# EAGLE design MainBoard (EAGLE 5.11)
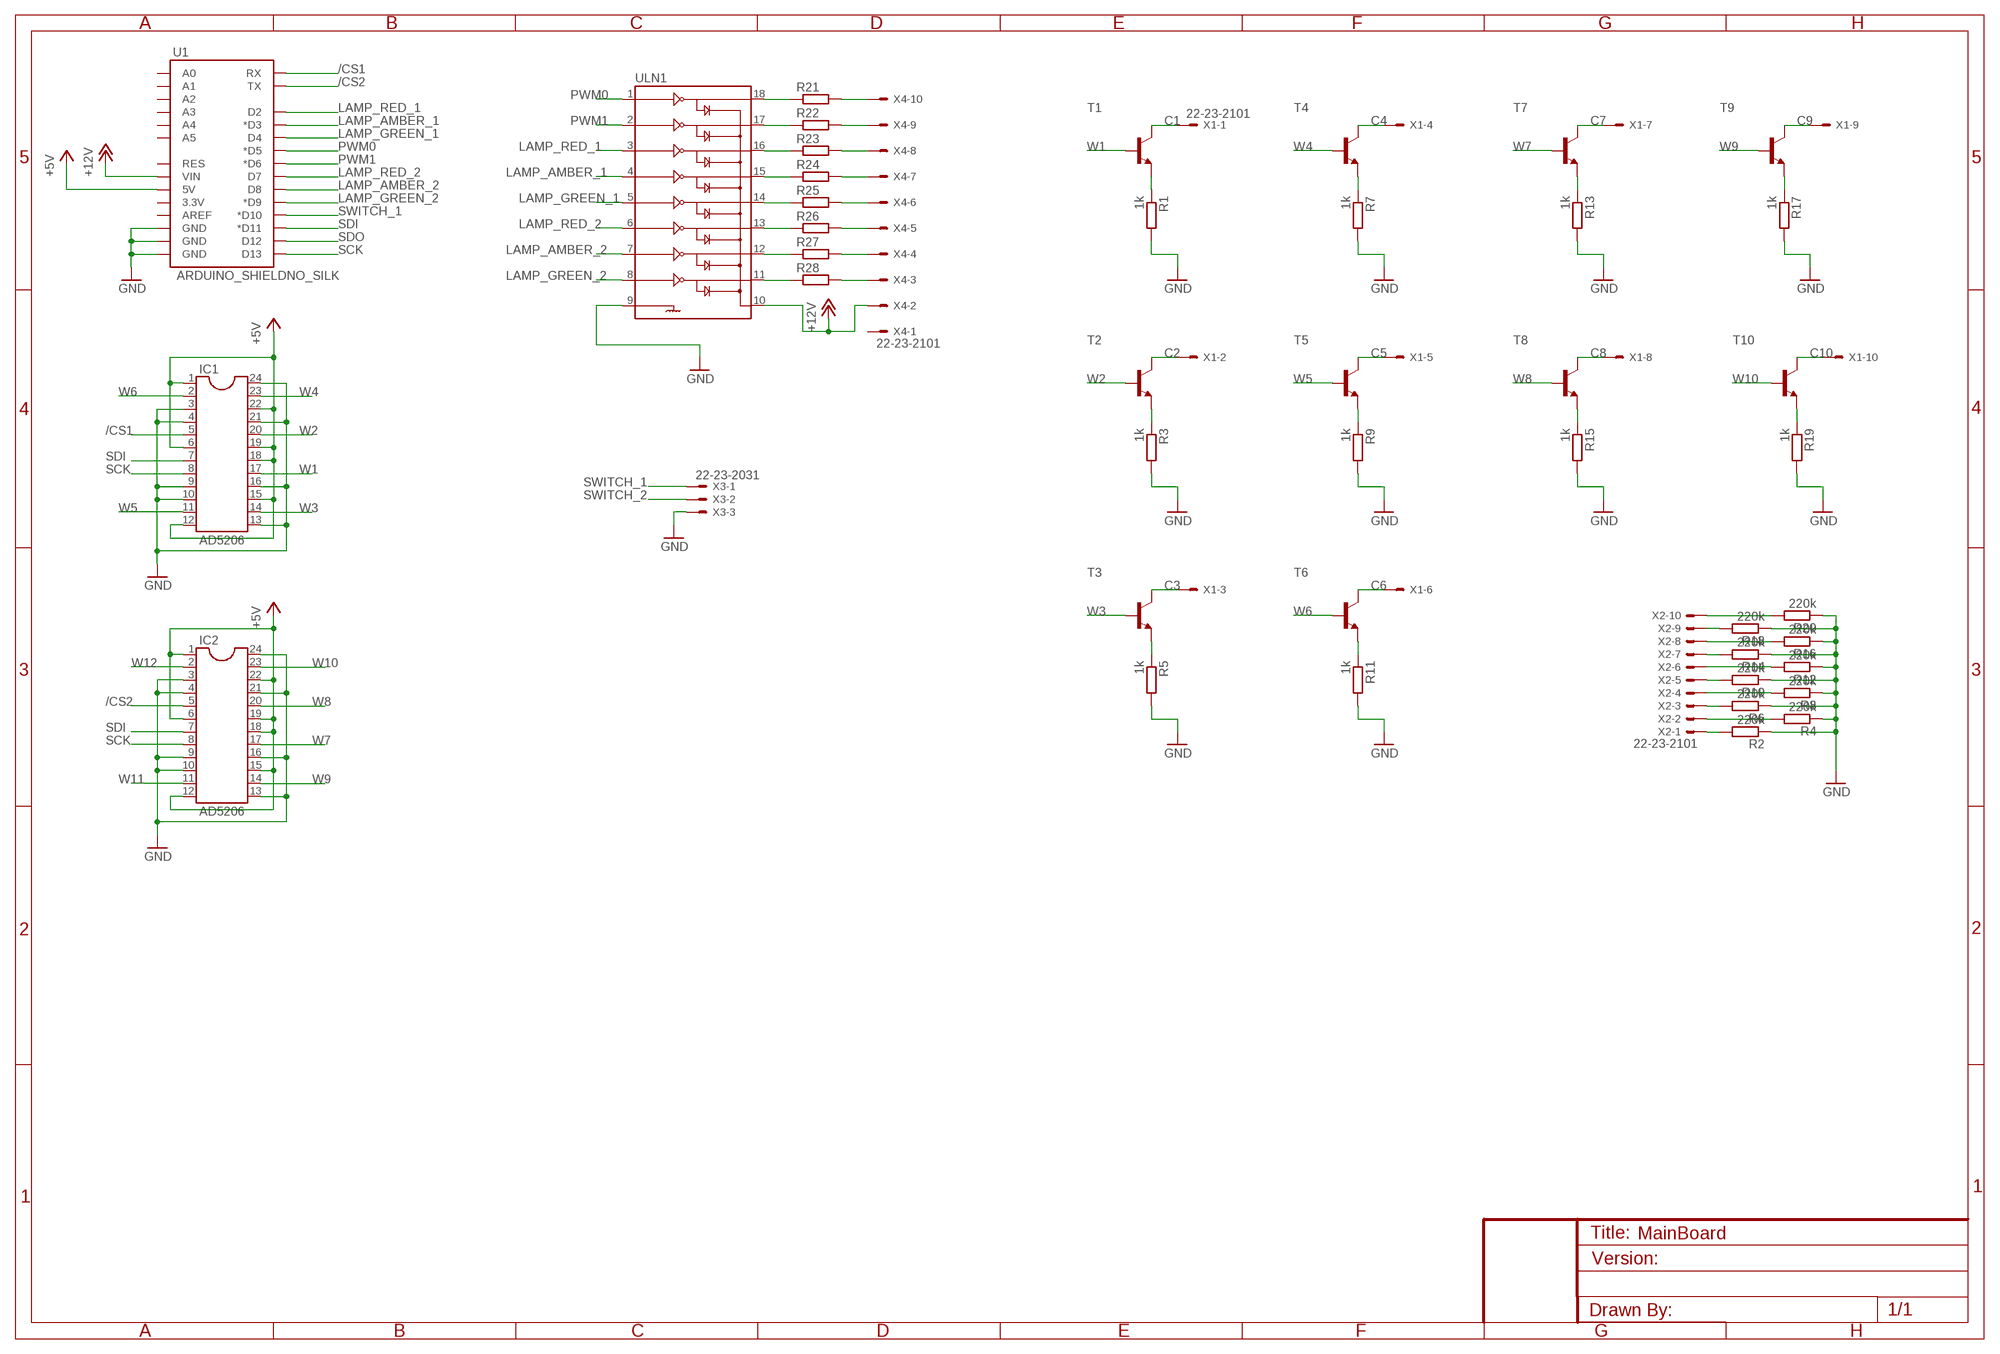
[diagram p0: schematic, sheet 1]

## Parts
IC1  AD5206  DIL24-3  [DIL24-3]
IC2  AD5206  DIL24-3  [DIL24-3]
R1  1k  R-EU_0207/2V  [0207/2V]
R2  220k  R-EU_0207/2V  [0207/2V]
R3  1k  R-EU_0207/2V  [0207/2V]
R4  220k  R-EU_0207/2V  [0207/2V]
R5  1k  R-EU_0207/2V  [0207/2V]
R6  220k  R-EU_0207/2V  [0207/2V]
R7  1k  R-EU_0207/2V  [0207/2V]
R8  220k  R-EU_0207/2V  [0207/2V]
R9  1k  R-EU_0207/2V  [0207/2V]
R10  220k  R-EU_0207/2V  [0207/2V]
R11  1k  R-EU_0207/2V  [0207/2V]
R12  220k  R-EU_0207/2V  [0207/2V]
R13  1k  R-EU_0207/2V  [0207/2V]
R14  220k  R-EU_0207/2V  [0207/2V]
R15  1k  R-EU_0207/2V  [0207/2V]
R16  220k  R-EU_0207/2V  [0207/2V]
R17  1k  R-EU_0207/2V  [0207/2V]
R18  220k  R-EU_0207/2V  [0207/2V]
R19  1k  R-EU_0207/2V  [0207/2V]
R20  220k  R-EU_0207/2V  [0207/2V]
R21  R-EU_0207/2V  [0207/2V]
R22  R-EU_0207/2V  [0207/2V]
R23  R-EU_0207/2V  [0207/2V]
R24  R-EU_0207/2V  [0207/2V]
R25  R-EU_0207/2V  [0207/2V]
R26  R-EU_0207/2V  [0207/2V]
R27  R-EU_0207/2V  [0207/2V]
R28  R-EU_0207/2V  [0207/2V]
T1  MPSA42-NPN-TO92-CBE  [TO92-CBE]
T2  MPSA42-NPN-TO92-CBE  [TO92-CBE]
T3  MPSA42-NPN-TO92-CBE  [TO92-CBE]
T4  MPSA42-NPN-TO92-CBE  [TO92-CBE]
T5  MPSA42-NPN-TO92-CBE  [TO92-CBE]
T6  MPSA42-NPN-TO92-CBE  [TO92-CBE]
T7  MPSA42-NPN-TO92-CBE  [TO92-CBE]
T8  MPSA42-NPN-TO92-CBE  [TO92-CBE]
T9  MPSA42-NPN-TO92-CBE  [TO92-CBE]
T10  MPSA42-NPN-TO92-CBE  [TO92-CBE]
U1  ARDUINO_SHIELDNO_SILK  [DUEMILANOVE_VIAS]
ULN1  ULN2803DIP  [DIL18]
X1  22-23-2101  [22-23-2101]
X2  22-23-2101  [22-23-2101]
X3  22-23-2031  [22-23-2031]
X4  22-23-2101  [22-23-2101]

## Nets
+5V: IC1.1 IC1.6 IC1.12 IC1.15 IC1.18 IC1.19 IC1.22 IC2.1 IC2.6 IC2.12 IC2.15 IC2.18 IC2.19 IC2.22 U1.5V
+12V: U1.VIN ULN1.10 X4.2
/CS1: IC1.5 U1.RX
/CS2: IC2.5 U1.TX
C1 [ht]: T1.C X1.1
C2 [ht]: T2.C X1.2
C3 [ht]: T3.C X1.3
C4 [ht]: T4.C X1.4
C5 [ht]: T5.C X1.5
C6 [ht]: T6.C X1.6
C7 [ht]: T7.C X1.7
C8 [ht]: T8.C X1.8
C9 [ht]: T9.C X1.9
C10 [ht]: T10.C X1.10
GND: IC1.3 IC1.4 IC1.9 IC1.10 IC1.13 IC1.16 IC1.21 IC1.24 IC2.3 IC2.4 IC2.9 IC2.10 IC2.13 IC2.16 IC2.21 IC2.24 R1.2 R2.1 R3.2 R4.1 R5.2 R6.1 R7.2 R8.1 R9.2 R10.1 R11.2 R12.1 R13.2 R14.1 R15.2 R16.1 R17.2 R18.1 R19.2 R20.1 U1.GND@0(GND) U1.GND@1(GND) U1.GND@2(GND) ULN1.9 X3.3
LAMP_AMBER_1: U1.D3(*D3) ULN1.4
LAMP_AMBER_2: U1.D8 ULN1.7
LAMP_GREEN_1: U1.D4 ULN1.5
LAMP_GREEN_2: U1.D9(*D9) ULN1.8
LAMP_RED_1: U1.D2 ULN1.3
LAMP_RED_2: U1.D7 ULN1.6
N$1: R1.1 T1.E
N$2: R13.1 T7.E
N$3: R20.2 X2.10
N$4: R18.2 X2.9
N$5: R16.2 X2.8
N$6: R14.2 X2.7
N$7: R12.2 X2.6
N$8: R10.2 X2.5
N$9: R5.1 T3.E
N$10: R8.2 X2.4
N$11: R6.2 X2.3
N$12: R7.1 T4.E
N$13: R21.1 ULN1.18
N$14: R4.2 X2.2
N$15: R9.1 T5.E
N$16: R22.1 ULN1.17
N$17: R3.1 T2.E
N$18: R2.2 X2.1
N$19: R11.1 T6.E
N$20: R23.1 ULN1.16
N$21: R24.1 ULN1.15
N$22: R25.1 ULN1.14
N$23: R26.1 ULN1.13
N$24: R15.1 T8.E
N$25: R27.1 ULN1.12
N$26: R28.1 ULN1.11
N$27: R17.1 T9.E
N$28: R21.2 X4.10
N$29: R22.2 X4.9
N$30: R19.1 T10.E
N$31: R23.2 X4.8
N$32: R24.2 X4.7
N$33: R25.2 X4.6
N$34: R26.2 X4.5
N$35: R27.2 X4.4
N$36: R28.2 X4.3
PWM0: U1.D5(*D5) ULN1.1
PWM1: U1.D6(*D6) ULN1.2
SCK: IC1.8 IC2.8 U1.D13
SDI: IC1.7 IC2.7 U1.D11(*D11)
SDO: U1.D12
SWITCH_1: U1.D10(*D10) X3.1
SWITCH_2: X3.2
W1: IC1.17 T1.B
W2: IC1.20 T2.B
W3: IC1.14 T3.B
W4: IC1.23 T4.B
W5: IC1.11 T5.B
W6: IC1.2 T6.B
W7: IC2.17 T7.B
W8: IC2.20 T8.B
W9: IC2.14 T9.B
W10: IC2.23 T10.B
W11: IC2.11
W12: IC2.2
Unconnected: U1.3.3V U1.A0 U1.A1 U1.A2 U1.A3 U1.A4 U1.A5 U1.AREF U1.RES X4.1

## Library data of the parts
IC1 IC2 = ic-package:DIL24: Dual In Line
R1-R28 = CustomisedParts:R-EU_: RESISTOR, European symbol
T1-T10 = transistor:*-NPN-: NPN Transistror BF959 corrected 2008.03.06
U1 = SparkFun:ARDUINO_SHIELD
ULN1 = SparkFun:ULN2803: Darlington Driver ULN2803 Darlington array. 500mA max per channel, 8-channel package. Spark Fun Electronics SKU : COM-00312
X1 X2 X4 = con-molex:22-23-2101: .100" (2.54mm) Center Header - 10 Pin; MF: MOLEX; MPN: 22-23-2101; OC_FARNELL: 1756828; OC_NEWARK: 94C0765
X3 = con-molex:22-23-2031: .100" (2.54mm) Center Header - 3 Pin; MF: MOLEX; MPN: 22-23-2031; OC_FARNELL: 1462950; OC_NEWARK: 30C0862

## Net classes
0 default: width 0.305 mm, clearance 0.254 mm
1 ht: width 0.508 mm, clearance 0.254 mm

## Board
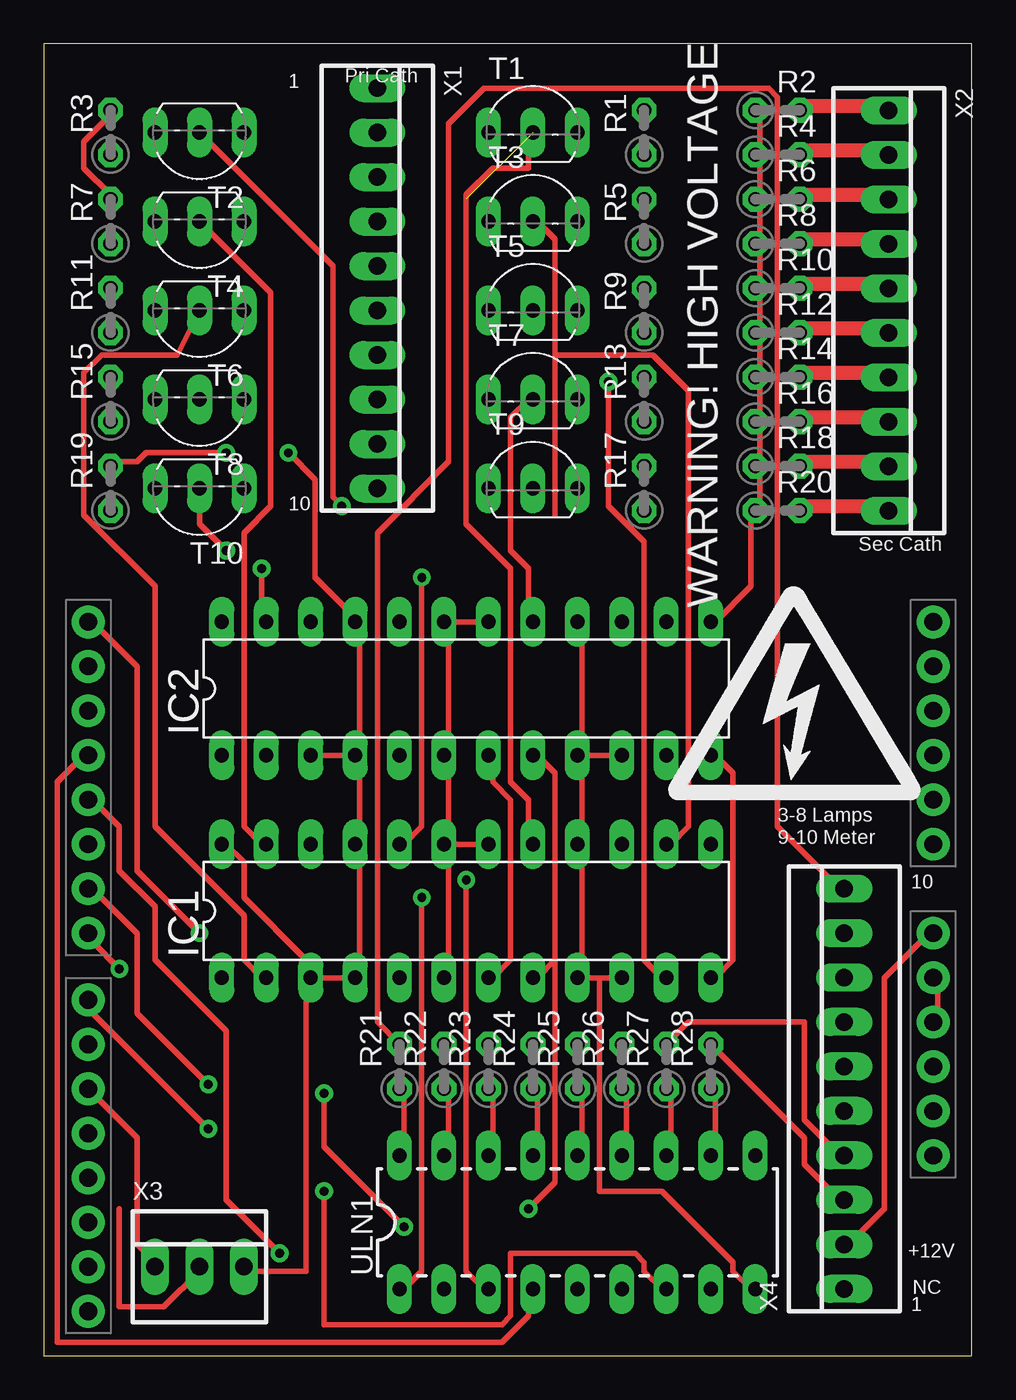
[diagram p1: board, top side]
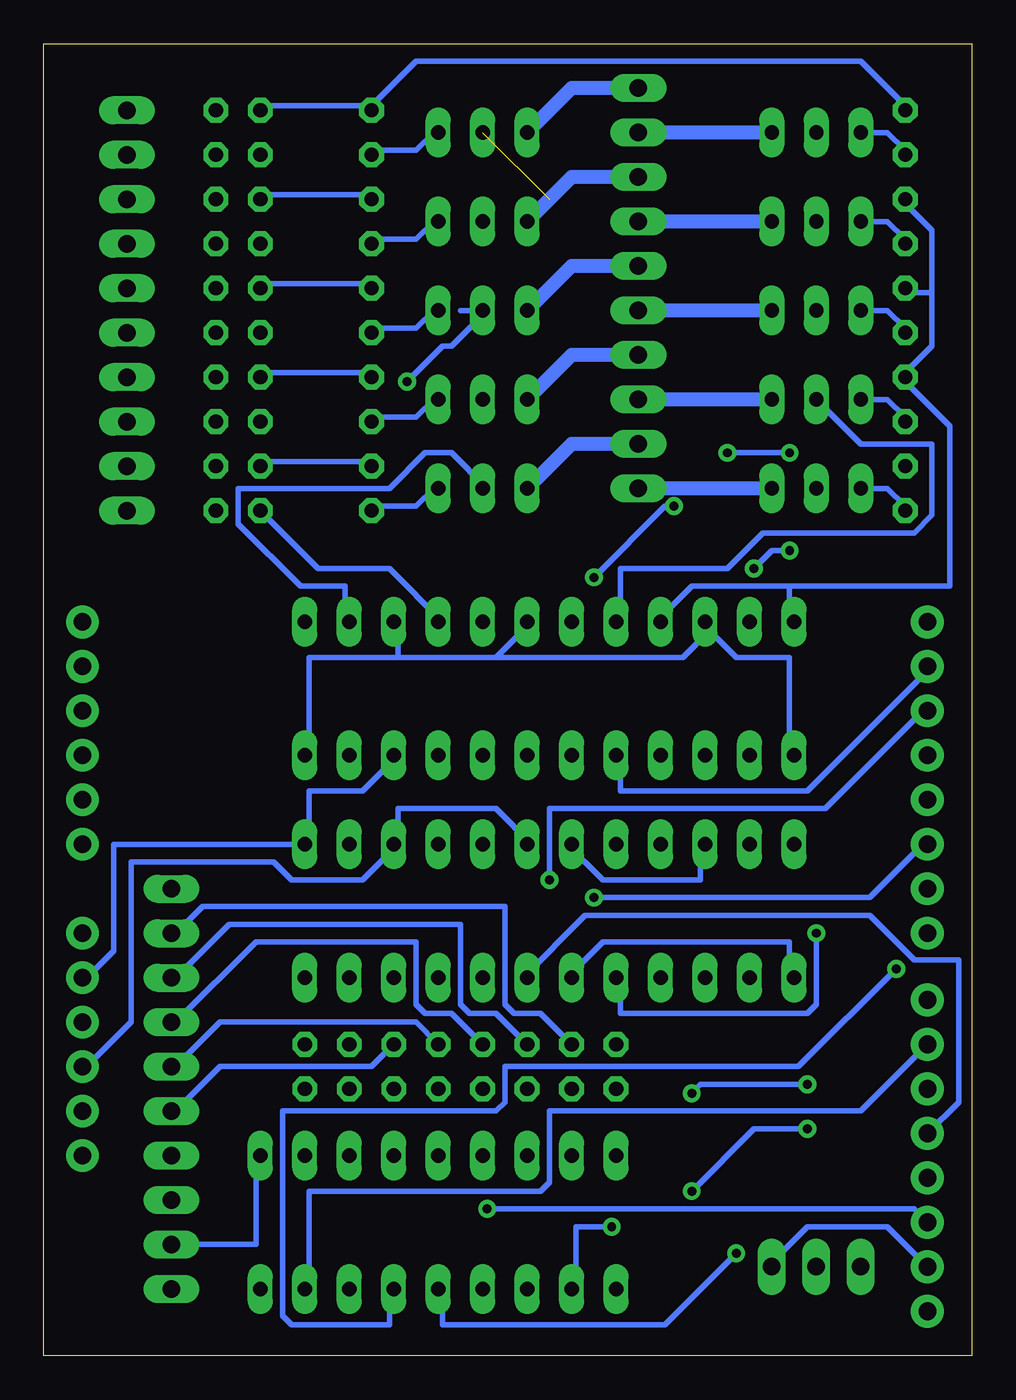
[diagram p2: board, bottom side, seen from below]

Size 53.01 x 74.92 mm. Coordinates in mm from the lower left corner, seen from the top.
Outline: 0,0 53.01,0 53.01,74.92 0,74.92 0,0
Copper layers (1*16): Top 0.035mm / dielectric 1.5mm / Bottom 0.035mm
Design rules "SparkFun": minimum track width 8mil, minimum drill 20mil, track to track 8mil, track to pad 8mil, pad to pad 8mil, via to via 8mil, smd to smd 8mil, copper to edge 10mil, drill to drill 8mil, minimum pad ring 12mil, minimum via ring 10mil, stop-mask expansion 4mil, vias tented up to drill 25mil, thermal gap 10mil

### Footprints (pad centres in the part's own frame; a part is rotated, then mirrored left to right if it is on the bottom)
DIL24-3 = drill 0.813 long: 1 -13.97,-3.81; 2 -11.43,-3.81; 3 -8.89,-3.81; 4 -6.35,-3.81; 5 -3.81,-3.81; 6 -1.27,-3.81; 7 1.27,-3.81; 8 3.81,-3.81; 9 6.35,-3.81; 10 8.89,-3.81; 11 11.43,-3.81; 12 13.97,-3.81; 13 13.97,3.81; 14 11.43,3.81; 15 8.89,3.81; 16 6.35,3.81; 17 3.81,3.81; 18 1.27,3.81; 19 -1.27,3.81; 20 -3.81,3.81; 21 -6.35,3.81; 22 -8.89,3.81; 23 -11.43,3.81; 24 -13.97,3.81
0207/2V = drill 0.813 octagon: 1 -1.27,0; 2 1.27,0
TO92-CBE = drill 0.813 long: B 0,0; C -2.54,0; E 2.54,0
DUEMILANOVE_VIAS = drill 1.016 pad 1.88 round: 3.3V 50.8,13.97; 5V 50.8,16.51; A0 50.8,29.21; A1 50.8,31.75; A2 50.8,34.29; A3 50.8,36.83; A4 50.8,39.37; A5 50.8,41.91; AREF 2.54,2.54; D2 2.54,36.83; D3 2.54,34.29; D4 2.54,31.75; D5 2.54,29.21; D6 2.54,26.67; D7 2.54,24.13; D8 2.54,20.32; D9 2.54,17.78; D10 2.54,15.24; D11 2.54,12.7; D12 2.54,10.16; D13 2.54,7.62; GND@0 50.8,19.05; GND@1 50.8,21.59; GND@2 2.54,5.08; RES 50.8,11.43; RX 2.54,41.91; TX 2.54,39.37; VIN 50.8,24.13
DIL18 = drill 0.813 long: 1 -10.16,-3.81; 2 -7.62,-3.81; 3 -5.08,-3.81; 4 -2.54,-3.81; 5 0,-3.81; 6 2.54,-3.81; 7 5.08,-3.81; 8 7.62,-3.81; 9 10.16,-3.81; 10 10.16,3.81; 11 7.62,3.81; 12 5.08,3.81; 13 2.54,3.81; 14 0,3.81; 15 -2.54,3.81; 16 -5.08,3.81; 17 -7.62,3.81; 18 -10.16,3.81
22-23-2101 = drill 1 long: 1 -11.43,0; 2 -8.89,0; 3 -6.35,0; 4 -3.81,0; 5 -1.27,0; 6 1.27,0; 7 3.81,0; 8 6.35,0; 9 8.89,0; 10 11.43,0
22-23-2031 = drill 1 long: 1 -2.54,0; 2 0,0; 3 2.54,0

### Placement (x,y rotation side)
IC1  24.13,25.4 0 top
IC2  24.13,38.1 0 top
R1  34.29,69.85 90 top
R2  41.91,71.12 0 top
R3  3.81,69.85 90 top
R4  41.91,68.58 0 top
R5  34.29,64.77 90 top
R6  41.91,66.04 0 top
R7  3.81,64.77 90 top
R8  41.91,63.5 0 top
R9  34.29,59.69 90 top
R10  41.91,60.96 0 top
R11  3.81,59.69 90 top
R12  41.91,58.42 0 top
R13  34.29,54.61 90 top
R14  41.91,55.88 0 top
R15  3.81,54.61 90 top
R16  41.91,53.34 0 top
R17  34.29,49.53 90 top
R18  41.91,50.8 0 top
R19  3.81,49.53 90 top
R20  41.91,48.26 0 top
R21  20.32,16.51 90 top
R22  22.86,16.51 90 top
R23  25.4,16.51 90 top
R24  27.94,16.51 90 top
R25  30.48,16.51 90 top
R26  33.02,16.51 90 top
R27  35.56,16.51 90 top
R28  38.1,16.51 90 top
T1  27.94,69.85 0 top
T2  8.89,69.85 180 top
T3  27.94,64.77 0 top
T4  8.89,64.77 180 top
T5  27.94,59.69 0 top
T6  8.89,59.69 180 top
T7  27.94,54.61 0 top
T8  8.89,54.61 180 top
T9  27.94,49.53 0 top
T10  8.89,49.53 180 top
U1  0,0 0 top
ULN1  30.48,7.62 0 top
X1  19.05,60.96 270 top
X2  48.26,59.69 270 top
X3  8.89,5.08 0 top
X4  45.72,15.24 90 top

### Tracks (layer width: path | path; a pad name or v marks a point on that pad's centre or on a via)
+5V
  Top 0.305: IC1.12 38.35,21.59 39.37,22.61 39.37,33.27 38.35,34.29 IC2.12 | 23.11,41.91 IC2.18 | 23.11,29.21 IC1.18 | 23.11,29.21 23.11,34.29 | 23.11,34.29 23.11,41.91 | 23.11,41.91 IC2.19 | 23.11,34.29 IC2.6 | 23.11,29.21 23.11,21.59 IC1.6 | 23.11,29.21 IC1.19
  Bottom 0.305: IC1.1 10.41,21.59 10.41,23.62 21.08,23.62 23.11,21.59 IC1.6 | 14.99,41.4 15.49,41.91 IC2.22 14.99,41.4 | 14.99,41.4 13.46,39.88 10.41,39.88 10.41,34.29 IC2.1 | 32.77,39.88 32.77,41.91 IC2.15 | 27.18,39.88 32.77,39.88 | 27.18,39.88 25.15,41.91 IC2.18 | IC1.22 15.49,29.21 15.49,27.18 21.08,27.18 23.11,29.21 IC1.19 | 32.77,29.21 32.77,31.24 27.18,31.24 25.15,29.21 IC1.18 | 32.77,29.21 34.8,27.18 38.86,27.18 39.88,28.19 48.01,28.19 48.01,19.05 50.55,16.51 U1.5V | 32.77,29.21 IC1.15 | 14.99,41.4 16.51,39.88 27.18,39.88 | 32.77,39.88 37.85,39.88 37.85,34.29 IC2.12
+12V
  Top 0.305: U1.VIN 50.55,24.13 48.01,21.59 48.01,8.38 45.97,6.35 X4.2
  Bottom 0.305: ULN1.10 40.89,11.43 40.89,6.35 X4.2
/CS1  (via drill 0.51)
  Top 0.305: v8.89,24.13 5.33,27.69 5.33,39.37 2.79,41.91 U1.RX
  Bottom 0.305: v8.89,24.13 8.89,20.07 9.4,19.56 20.07,19.56 20.07,21.59 IC1.5
/CS2
  Bottom 0.305: IC2.5 20.07,34.29 20.07,32.26 9.4,32.26 2.29,39.37 U1.TX
C1
  Bottom 0.813: T1.C 22.86,72.39 X1.1
C2
  Bottom 0.813: T2.C X1.2
C3
  Bottom 0.813: T3.C 22.86,67.31 X1.3
C4
  Bottom 0.813: T4.C X1.4
C5
  Bottom 0.813: T5.C 22.86,62.23 X1.5
C6
  Bottom 0.813: T6.C X1.6
C7
  Bottom 0.813: T7.C 22.86,57.15 X1.7
C8
  Bottom 0.813: T8.C X1.8
C9
  Bottom 0.813: T9.C 22.86,52.07 X1.9
C10
  Bottom 0.813: T10.C X1.10
GND  (via drill 0.51)
  Top 0.305: R3.2 3.81,70.87 2.29,69.34 2.29,67.82 3.81,66.29 R7.2 | v10.41,51.56 5.84,51.56 5.33,51.05 3.81,51.05 R19.2 | R2.1 40.89,70.87 40.89,68.83 R4.1 40.89,68.33 40.89,66.29 R6.1 40.89,65.79 40.89,63.75 R8.1 40.89,63.25 40.89,61.21 R10.1 40.89,60.71 40.89,58.67 R12.1 40.89,58.17 40.89,56.13 R14.1 40.89,55.63 40.89,53.59 R16.1 40.89,53.09 40.89,51.05 R18.1 40.89,50.55 40.89,48.51 R20.1 40.39,48.01 40.39,43.94 38.35,41.91 IC2.13 | U1.GND@0 51.05,19.05 51.05,21.59 U1.GND@1 | 30.73,21.59 31.75,21.59 | 31.75,21.59 IC1.10 | 31.75,21.59 31.75,9.4 35.31,9.4 39.37,5.33 39.37,4.83 40.39,3.81 ULN1.9 | 30.73,34.29 30.73,29.21 | 30.73,34.29 30.73,41.91 IC2.16 | 18.03,29.21 18.03,34.29 | IC2.3 IC2.4 18.03,34.29 | 14.99,21.59 14.99,22.61 11.43,26.16 11.43,28.19 10.41,29.21 IC1.24 | 18.03,29.21 18.03,21.59 IC1.4 IC1.3 14.99,21.59 | 18.03,29.21 IC1.21 | 18.03,34.29 18.03,41.91 IC2.21 17.53,41.91 17.53,42.42 15.49,44.45 15.49,50.04 v13.97,51.56 | 14.99,21.59 14.99,4.83 11.43,4.83 X3.3 | 30.73,29.21 30.73,21.59 | 30.73,21.59 IC1.9 | 30.73,29.21 IC1.16 | 30.73,34.29 IC2.10 | 30.73,34.29 IC2.9
  Bottom 0.305: 2.29,60.71 2.29,57.66 3.81,56.13 R15.2 3.81,55.63 1.27,53.09 1.27,43.94 10.41,43.94 | 2.29,60.71 3.81,60.71 R11.2 | 2.29,60.71 2.29,64.26 3.81,65.79 R7.2 | v13.97,51.56 v10.41,51.56 | 34.29,71.37 40.39,71.37 R2.1 | R5.2 34.29,66.29 40.39,66.29 R6.1 | R9.2 34.29,61.21 40.39,61.21 R10.1 | R17.2 34.29,51.05 40.39,51.05 R18.1 | R13.2 34.29,56.13 40.39,56.13 R14.1 | IC2.10 32.77,34.29 34.8,32.26 37.85,32.26 37.85,29.21 IC1.13 49.02,29.21 49.02,23.11 50.55,21.59 U1.GND@1 | R20.1 37.34,44.96 33.27,44.96 30.23,41.91 IC2.16 | X3.3 11.43,5.33 9.4,7.37 4.83,7.37 U1.GND@2 | 10.41,43.94 10.41,41.91 IC2.24 | 10.41,43.94 16,43.94 18.03,41.91 IC2.21 | 34.29,71.37 31.75,73.91 6.35,73.91 3.81,71.37 R3.2 | 34.29,71.37 R1.2
LAMP_AMBER_1
  Top 0.305: ULN1.4 27.69,3.81 27.69,2.29 26.16,0.76 0.76,0.76 0.76,32.77 2.29,34.29 U1.D3
LAMP_AMBER_2  (via drill 0.51)
  Top 0.305: v16,9.4 16,1.78 26.16,1.78 26.67,2.29 26.67,5.84 33.78,5.84 34.29,5.33 34.29,4.83 35.31,3.81 ULN1.7 | v9.4,12.95 2.79,19.56 2.79,20.07 U1.D8
  Bottom 0.305: v16,9.4 12.45,12.95 v9.4,12.95
LAMP_GREEN_1  (via drill 0.51)
  Top 0.305: v13.46,5.84 10.41,8.89 10.41,18.54 6.35,22.61 6.35,25.65 4.32,27.69 4.32,30.23 2.79,31.75 U1.D4
  Bottom 0.305: v13.46,5.84 17.53,1.78 30.23,1.78 30.23,3.81 ULN1.5
LAMP_GREEN_2
  Bottom 0.305: ULN1.8 37.85,3.81 37.85,9.4 24.64,9.4 24.13,9.91 24.13,13.97 6.35,13.97 U1.D9
LAMP_RED_1  (via drill 0.51)
  Top 0.305: v24.13,27.18 24.13,4.83 25.15,3.81 ULN1.3
  Bottom 0.305: v24.13,27.18 24.13,31.24 8.38,31.24 2.79,36.83 U1.D2
LAMP_RED_2  (via drill 0.51)
  Top 0.305: v4.32,22.1 2.79,23.62 2.79,24.13 U1.D7
  Bottom 0.305: v4.32,22.1 9.91,16.51 26.67,16.51 26.67,14.48 27.18,13.97 39.37,13.97 39.37,2.29 38.86,1.78 33.27,1.78 33.27,3.81 ULN1.6
N$1
  Bottom 0.305: T1.E 30.73,69.85 31.75,68.83 34.29,68.83 R1.1
N$2
  Bottom 0.305: T7.E 30.73,54.61 31.75,53.59 34.29,53.59 R13.1
N$3
  Top 0.813: R20.2 43.43,48.51 48.01,48.51 X2.10
N$4
  Top 0.813: R18.2 43.43,51.05 48.01,51.05 X2.9
N$5
  Top 0.813: R16.2 43.43,53.59 48.01,53.59 X2.8
N$6
  Top 0.813: R14.2 43.43,56.13 48.01,56.13 X2.7
N$7
  Top 0.813: R12.2 43.43,58.67 48.01,58.67 X2.6
N$8
  Top 0.813: R10.2 43.43,61.21 48.01,61.21 X2.5
N$9
  Bottom 0.305: T3.E 30.73,64.77 31.75,63.75 34.29,63.75 R5.1
N$10
  Top 0.813: R8.2 43.43,63.75 48.01,63.75 X2.4
N$11
  Top 0.813: R6.2 43.43,66.29 48.01,66.29 X2.3
N$12
  Bottom 0.305: T4.E 4.83,64.77 3.81,63.75 R7.1
N$13
  Top 0.305: ULN1.18 20.57,11.43 20.57,14.99 R21.1
N$14
  Top 0.813: R4.2 43.43,68.83 48.01,68.83 X2.2
N$15
  Bottom 0.305: T5.E 30.73,59.69 31.75,58.67 34.29,58.67 R9.1
N$16
  Top 0.305: ULN1.17 23.11,11.43 23.11,14.99 R22.1
N$17
  Bottom 0.305: T2.E 4.83,69.85 3.81,68.83 R3.1
N$18
  Top 0.813: R2.2 43.43,71.37 48.01,71.37 X2.1
N$19
  Bottom 0.305: T6.E 4.83,59.69 3.81,58.67 R11.1
N$20
  Top 0.305: ULN1.16 25.65,11.43 25.65,14.99 R23.1
N$21
  Top 0.305: ULN1.15 28.19,11.43 28.19,14.99 R24.1
N$22
  Top 0.305: ULN1.14 30.73,11.43 30.73,14.99 R25.1
N$23
  Top 0.305: ULN1.13 33.27,11.43 33.27,14.99 R26.1
N$24
  Bottom 0.305: T8.E 4.83,54.61 3.81,53.59 R15.1
N$25
  Top 0.305: ULN1.12 35.81,11.43 35.81,14.99 R27.1
N$26
  Top 0.305: ULN1.11 38.35,11.43 38.35,14.99 R28.1
N$27
  Bottom 0.305: T9.E 30.73,49.53 31.75,48.51 34.29,48.51 R17.1
N$28
  Top 0.305: R21.2 19.05,19.05 19.05,46.99 23.11,51.05 23.11,70.36 25.15,72.39 41.4,72.39 41.91,71.88 41.91,30.23 45.47,26.67 X4.10
N$29
  Bottom 0.305: R22.2 24.64,19.56 26.16,19.56 26.67,20.07 26.67,25.65 43.94,25.65 45.47,24.13 X4.9
N$30
  Bottom 0.305: T10.E 4.83,49.53 3.81,48.51 R19.1
N$31
  Bottom 0.305: R23.2 27.18,19.56 28.7,19.56 29.21,20.07 29.21,24.64 42.42,24.64 45.47,21.59 X4.8
N$32
  Bottom 0.305: R24.2 29.72,19.56 31.24,19.56 31.75,20.07 31.75,23.62 40.89,23.62 45.47,19.05 X4.7
N$33
  Bottom 0.305: R25.2 31.75,19.05 42.93,19.05 45.47,16.51 X4.6
N$34
  Bottom 0.305: R26.2 34.29,16.51 42.93,16.51 45.47,13.97 X4.5
N$35
  Top 0.305: R27.2 36.83,19.05 43.43,19.05 43.43,13.46 45.47,11.43 X4.4
N$36
  Top 0.305: R28.2 43.43,12.45 43.43,10.92 45.47,8.89 X4.3
PWM0  (via drill 0.51)
  Top 0.305: v21.59,26.16 21.59,4.83 20.57,3.81 ULN1.1
  Bottom 0.305: v21.59,26.16 5.84,26.16 2.79,29.21 U1.D5
PWM1  (via drill 0.51)
  Top 0.305: v20.57,7.37 16,11.94 v16,14.99 | v9.4,15.49 5.33,19.56 5.33,24.13 2.79,26.67 U1.D6
  Bottom 0.305: v20.57,7.37 22.61,7.37 22.61,3.81 ULN1.2 | v16,14.99 15.49,15.49 v9.4,15.49
SCK  (via drill 0.51)
  Top 0.305: 29.21,22.61 28.19,21.59 IC1.8 | 29.21,22.61 29.21,33.27 28.19,34.29 IC2.8 | v27.69,8.38 29.21,9.91 29.21,22.61
  Bottom 0.305: v27.69,8.38 3.3,8.38 U1.D13
SDI
  Top 0.305: IC1.7 25.65,21.59 26.67,22.61 26.67,31.75 25.65,32.77 25.65,34.29 IC2.7
  Bottom 0.305: U1.D11 0.76,14.48 0.76,22.61 3.3,22.61 5.84,25.15 22.1,25.15 25.65,21.59 IC1.7
SWITCH_1
  Top 0.305: X3.1 6.35,5.33 5.33,6.35 5.33,12.45 U1.D10
SWITCH_2
  Top 0.305: 4.32,8.38 4.32,2.79 6.86,2.79 8.89,4.83 X3.2
W1  (1 unrouted)
  Top 0.305: IC1.17 27.69,29.21 27.69,31.75 26.67,32.77 26.67,44.96 24.13,47.5 24.13,66.29 25.65,67.82 27.69,67.82 27.69,69.85 T1.B
W2  (via drill 0.51)
  Top 0.305: T2.B 16.51,62.23 16.51,49.02 v17.02,48.51 | v21.59,44.45 21.59,30.23 20.57,29.21 IC1.20
  Bottom 0.305: v21.59,44.45 17.53,48.51 v17.02,48.51
W3
  Top 0.305: 29.21,57.15 29.21,48.01 | 29.21,57.15 29.21,63.75 28.19,64.77 T3.B | 29.21,57.15 34.8,57.15 36.83,55.12 36.83,30.23 35.81,29.21 IC1.14
W4
  Top 0.305: T4.B 12.95,60.71 12.95,48.51 11.43,46.99 11.43,30.23 12.45,29.21 IC1.23
W5  (via drill 0.51)
  Top 0.305: v32.26,55.63 32.26,48.51 34.29,46.48 34.29,22.61 35.31,21.59 IC1.11
  Bottom 0.305: 29.21,59.69 T5.B 27.69,59.69 29.72,57.66 30.23,57.66 v32.26,55.63
W6
  Top 0.305: T6.B 7.62,57.15 3.3,57.15 2.29,56.13 2.29,48.01 6.35,43.94 6.35,30.23 11.43,25.15 11.43,22.61 12.45,21.59 IC1.2
W7
  Top 0.305: T7.B 27.69,54.61 26.67,53.59 26.67,45.97 27.69,44.96 27.69,41.91 IC2.17
W8
  Bottom 0.305: T8.B 6.35,52.07 2.29,52.07 2.29,48.01 3.3,46.99 11.94,46.99 13.97,44.96 20.07,44.96 20.07,41.91 IC2.20
W9
  Bottom 0.305: IC2.14 35.81,41.91 35.81,43.94 38.35,43.94 41.91,47.5 41.91,49.53 33.27,49.53 31.24,51.56 29.72,51.56 27.69,49.53 T9.B
W10  (via drill 0.51)
  Top 0.305: v12.45,44.96 12.45,41.91 IC2.23 | v10.41,45.97 8.89,47.5 T10.B
  Bottom 0.305: v12.45,44.96 11.43,45.97 v10.41,45.97

### Text on the board
tPlace: 1 | Pri Cath | 10 | Sec Cath | WARNING! HIGH VOLTAGE | 3-8 Lamps | 9-10 Meter | 10 | +12V | NC | 1 | F:/high_voltage.bmp